# Altium schematic sheet Power.SchDoc
size A
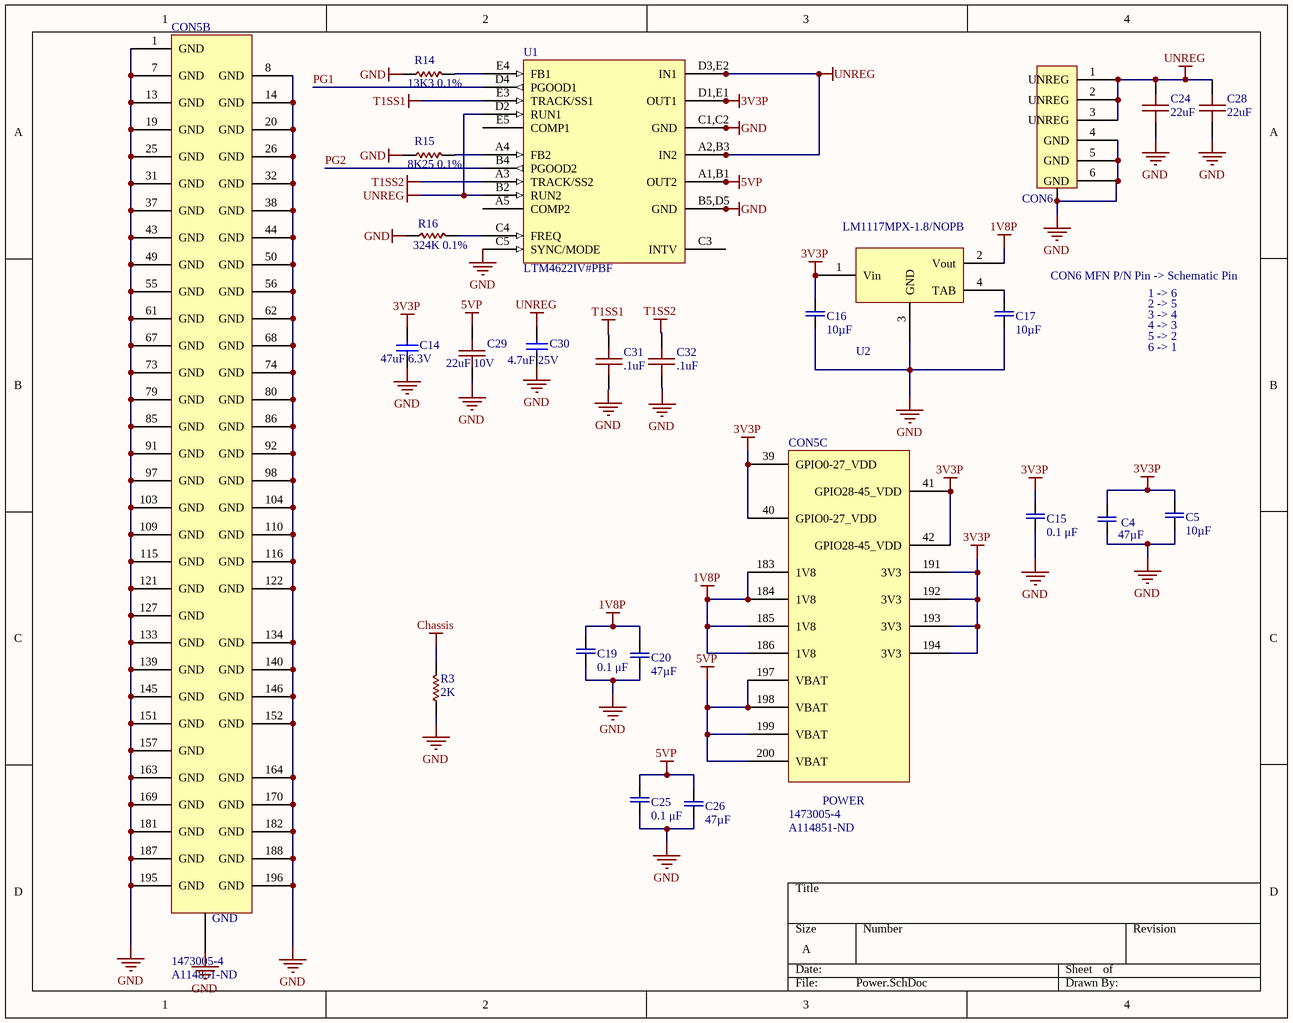
[diagram p0: Power.SchDoc]

## Parts
C4  Capacitance: 47µF  [1210_X7R_KEMET_above4.7uF]  (hidden comment: C1210C476M8RAC7800)
C5  Capacitance: 10µF  [0805_X7R_KEMET]  (hidden comment: C0805C106M8RACTU)
C14  47uF 6.3V  [CAPC0805(2012)145_M]
C15  Capacitance: 0.1 μF  [0805_X7R_KEMET]  (hidden comment: C0805C104K5RACTU)
C16  Capacitance: 10µF  [0805_X7R_KEMET]  (hidden comment: C0805C106M8RACTU)
C17  Capacitance: 10µF  [0805_X7R_KEMET]  (hidden comment: C0805C106M8RACTU)
C19  Capacitance: 0.1 μF  [0805_X7R_KEMET]  (hidden comment: C0805C104K5RACTU)
C20  Capacitance: 47µF  [1210_X7R_KEMET_above4.7uF]  (hidden comment: C1210C476M8RAC7800)
C24  22uF  [0805 B]
C25  Capacitance: 0.1 μF  [0805_X7R_KEMET]  (hidden comment: C0805C104K5RACTU)
C26  Capacitance: 47µF  [1210_X7R_KEMET_above4.7uF]  (hidden comment: C1210C476M8RAC7800)
C28  22uF  [0805 B]
C29  22uF 10V  [0805 B]
C30  4.7uF 25V  [CAPC0603(1608)100_N]
C31  .1uF  [0402 B]
C32  .1uF  [0402 B]
CON5  1473005-4  Supplier Part Number 1: A114851-ND  [SODIMM SOCKET .6 PITCH 200 POS RIGHT ANGLE]  (parts B,C of 9)
CON6  T1M-06-F-SH-L-K  [T1M-06-F-SH-L-K]  (value not drawn)
R3  2K  [0402]
R14  13K3 0.1%  [0402]
R15  8K25 0.1%  [0402]
R16  324K 0.1%  [0603]
U1  LTM4622IV#PBF  [LGA 25]
U2  LM1117MPX-1.8/NOPB  [SOT230P700X180-4N]

## Nets
1V8P: C19.1 C20.1 CON5.183(1V8) CON5.184(1V8) CON5.185(1V8) CON5.186(1V8) U2.2(Vout)
3V3P: C4.1 C5.1 C14.2 C15.1 C16.1 CON5.39(GPIO0-27_VDD) CON5.40(GPIO0-27_VDD) CON5.41(GPIO28-45_VDD) CON5.42(GPIO28-45_VDD) CON5.191(3V3) CON5.192(3V3) CON5.193(3V3) CON5.194(3V3) U1.D1,E1(OUT1) U1.E1(OUT1) U2.1(Vin)
5VP: C25.1 C26.1 C29.2 CON5.197(VBAT) CON5.198(VBAT) CON5.199(VBAT) CON5.200(VBAT) U1.A1,B1(OUT2) U1.B1(OUT2)
Chassis: R3.1
GND: C4.2 C5.2 C14.1 C15.2 C16.2 C17.2 C19.2 C20.2 C24.1 C25.2 C26.2 C28.1 C29.1 C30.1 C31.1 C32.1 CON5.1(GND) CON5.7(GND) CON5.8(GND) CON5.13(GND) CON5.14(GND) CON5.19(GND) CON5.20(GND) CON5.25(GND) CON5.26(GND) CON5.31(GND) CON5.32(GND) CON5.37(GND) CON5.38(GND) CON5.43(GND) CON5.44(GND) CON5.49(GND) CON5.50(GND) CON5.55(GND) CON5.56(GND) CON5.61(GND) CON5.62(GND) CON5.67(GND) CON5.68(GND) CON5.73(GND) CON5.74(GND) CON5.79(GND) CON5.80(GND) CON5.85(GND) CON5.86(GND) CON5.91(GND) CON5.92(GND) CON5.97(GND) CON5.98(GND) CON5.103(GND) CON5.104(GND) CON5.109(GND) CON5.110(GND) CON5.115(GND) CON5.116(GND) CON5.121(GND) CON5.122(GND) CON5.127(GND) CON5.133(GND) CON5.134(GND) CON5.139(GND) CON5.140(GND) CON5.145(GND) CON5.146(GND) CON5.151(GND) CON5.152(GND) CON5.157(GND) CON5.163(GND) CON5.164(GND) CON5.169(GND) CON5.170(GND) CON5.181(GND) CON5.182(GND) CON5.187(GND) CON5.188(GND) CON5.195(GND) CON5.196(GND) CON5.GND CON6.4(GND) CON6.5(GND) CON6.6(GND) CON6.GND R3.2 R14.2 R15.2 R16.2 U1.B5,D5(GND) U1.C1,C2(GND) U1.C2(GND) U1.C5(SYNC/MODE) U1.D5(GND) U2.3(GND)
T1SS1: C31.2 U1.E3(TRACK/SS1)
T1SS2: C32.2 U1.A3(TRACK/SS2)
UNREG: C24.2 C28.2 C30.2 CON6.1(UNREG) CON6.2(UNREG) CON6.3(UNREG) U1.A2,B3(IN2) U1.B2(RUN2) U1.B3(IN2) U1.D2(RUN1) U1.D3,E2(IN1) U1.E2(IN1)
PG1: U1.D4(PGOOD1)
PG2: U1.B4(PGOOD2)
NetC17_1: C17.1 U2.4(TAB)
NetR14_1: R14.1 U1.E4(FB1)
NetR15_1: R15.1 U1.A4(FB2)
NetR16_1: R16.1 U1.C4(FREQ)

Not connected (* = marked no-connect by the designer): U1 A5(COMP2) C3(INTV) E5(COMP1)

## Notes on the sheet
- CON6 MFN P/N Pin -> Schematic Pin
- 1 -> 6
- 2 -> 5
- 3 -> 4
- 4 -> 3
- 5 -> 2
- 6 -> 1
- (in symbol 1473005-4, part C) POWER

## Library data of the parts
C4 C20 C26 = C1210C476M8RAC7800: Manufacturer: Kemet; Tolerance: ±20%; Voltage - Rated: 10V; Temperature Coefficient: X7R; Supplier 1: Digikey; Manufacturer Part Number: C1210C476M8RAC7800; Stock 1: 9455; Pricing 1: 1=1.47, 10=1.159, 25=1.0628, 50=1.0046, 100=0.8694, 250=0.7728, 500=0.6569 (USD); Category: Capacitors; Family: Ceramic Capacitors; Series: C; Packaging: Tape &amp; Reel (TR); Mounting Type: Surface Mount, MLCC; Operating Temperature: -55°C ~ 125°C; Applications: General Purpose; Ratings: -; Package / Case: 1210 (3225 Metric); Size / Dimension: 0.126" L x 0.098" W (3.20mm x 2.50mm); Height - Seated (Max): -; Thickness (Max): 0.110" (2.80mm); Lead Spacing: -; Features: -; Lead Style: -; ComponentLink1URL: http://www.alliedelec.com/m/d/51f554c3dd800f51434b811e71a34895.pdf; ComponentLink1Description: http://www.alliedelec.com/m/d/51f554c3dd800f51434b811e71a34895.pdf; Supplier Part Number 1: 399-12072-1-ND
C5 C16 C17 = C0805C106M8RACTU: Manufacturer: Kemet; Capacitance Tolerance: ± 20%; Capacitor Case Style: 0805 [2012 Metric]; Dielectric Characteristic: X7R; Product Range: KEMET - C Series; SVHC: No SVHC (16-Jun-2014); Voltage Rating: 10V; Supplier 1: Digikey; Manufacturer Part Number: C0805C106M8RACTU; Stock 1: 17950; Pricing 1: 1=0.52, 10=0.362, 25=0.2972, 50=0.2536, 100=0.2174, 250=0.1811, 500=0.163, 1000=0.1377 (USD); Ceramic Capacitor Case: 0805 [2012 Metric]; MSL: MSL 1 - Unlimited; Operating Temperature Max: 125°C; Operating Temperature Min: -55°C; Packaging: Tape & Reel; ComponentLink1URL: https://datasheet.ciiva.com/5408/kem-c1002-x7r-smd-5408794.pdf; ComponentLink1Description: https://datasheet.ciiva.com/5408/kem-c1002-x7r-smd-5408794.pdf; Supplier Part Number 1: 399-7413-1-ND
C14 = CMP-1036-04876-1: GRM21BR60J476ME15L; Case-EIA: 0805; Case-Metric: 2012; Tolerance: Â±10%; Value: 4.7uF; Technology: SMT; Max Thickness: 1.45 mm; Rated Voltage: 6.3 V
C15 C19 C25 = C0805C104K5RACTU: Manufacturer: Kemet; Manufacturer Part Number: C0805C104K5RAC-TU; Brand/Series: C Series; Dielectric Characteristic: X7R; Material, Element: Ceramic; Tolerance: -10, +10 %; Voltage, Rating: 50 VDC; Supplier 1: Digikey; Stock 1: 2895664; Pricing 1: 1=0.1, 10=0.053, 25=0.0388, 50=0.029, 100=0.0237, 250=0.0198, 500=0.0169, 1000=0.0133 (USD); Case Size: 0805 (2012 mm); Dimensions: 0.079" x 0.049" (2 x 1.25mm) LxW; Mounting Type: PCB; Packaging: Cut Tape; Termination: SMD; ComponentLink1URL: https://datasheet.ciiva.com/14589/70095383-14589048.pdf; ComponentLink1Description: https://datasheet.ciiva.com/14589/70095383-14589048.pdf; ComponentLink2URL: https://datasheet.ciiva.com/28682/1851736-28682232.pdf; ComponentLink2Description: https://datasheet.ciiva.com/28682/1851736-28682232.pdf; ComponentLink3URL: https://datasheet.ciiva.com/7842/1851736-7842539.pdf; ComponentLink3Description: https://datasheet.ciiva.com/7842/1851736-7842539.pdf; ComponentLink4URL: https://datasheet.ciiva.com/32431/slceramic-chip-condensers-e-32431755.pdf; ComponentLink4Description: https://datasheet.ciiva.com/32431/slceramic-chip-condensers-e-32431755.pdf; ComponentLink5URL: https://datasheet.ciiva.com/18410/70095383-18410815.pdf; ComponentLink5Description: https://datasheet.ciiva.com/18410/70095383-18410815.pdf; Supplier Part Number 1: 399-1170-1-ND
C24 C28 C29 = CAP 0805: 805 Capacitor
C30 = CMP-1035-01192-1: GRM188C81E475KE11D; Value: 75pF; Case-Metric: 1608; Case-EIA: 0603; Tolerance: Â±10%; Technology: SMT; Rated Voltage: 25 V; Max Thickness: 1 mm
C31 C32 = CAP 0402: 402 Capacitor; Value: .1uF
CON5 = 1473005-4: Manufacturer: TE Connectivity (Tyco Electronics); Unit PriceUSD: AMP; Minimum Quantity: SODIMM; 3D Model: 1473005-4.pdf; Number of Positions: 200; Memory Type: DDR 2 SDRAM; Other Names: 1473005-4-ND / A114851; Supplier 1: Digikey; Manufacturer Part Number: 1473005-4; Stock 1: 1922; Pricing 1: 1=3.9, 10=3.744, 50=3.276, 100=3.12, 250=2.73, 500=2.652, 1000=2.262, 2500=2.106 (USD); Quantity Available: Tray; RoHS Information: 1473005-4 Statement of Compliance / RoHS 2 Statement; Standard Package: 20; Category: Connectors, Interconnects; Family: Memory Connectors - Inline Module Sockets; Series: AMP; Packaging: Tray; Connector Style: SODIMM; Mounting Type: Surface Mount, Right Angle; Features: Board Guide, Latches; Mounting Feature: Standard; Contact Finish: Gold; Contact Finish Thickness: Flash; ComponentLink1URL: https://datasheet.ciiva.com/682/eng-cd-1473005-j2-682720.pdf; ComponentLink1Description: https://datasheet.ciiva.com/682/eng-cd-1473005-j2-682720.pdf; ComponentLink2URL: https://datasheet.ciiva.com/15171/getdatasheetpartid-99150-15171488.pdf; ComponentLink2Description: https://datasheet.ciiva.com/15171/getdatasheetpartid-99150-15171488.pdf; ComponentLink3URL: https://datasheet.ciiva.com/1105/582309-1105221.pdf; ComponentLink3Description: https://datasheet.ciiva.com/1105/582309-1105221.pdf; ComponentLink4URL: https://datasheet.ciiva.com/682/eng-cd-1473005-j2-682726.pdf; ComponentLink4Description: https://datasheet.ciiva.com/682/eng-cd-1473005-j2-682726.pdf; ComponentLink5URL: https://datasheet.ciiva.com/14156/04821302-14156311.pdf; ComponentLink5Description: https://datasheet.ciiva.com/14156/04821302-14156311.pdf; ComponentLink6URL: https://datasheet.ciiva.com/3136/eng-cd-1473005-j-3136060.pdf; ComponentLink6Description: https://datasheet.ciiva.com/3136/eng-cd-1473005-j-3136060.pdf; ComponentLink7URL: https://datasheet.ciiva.com/16380/eng-cd-1473005-j-16380909.pdf; ComponentLink7Description: https://datasheet.ciiva.com/16380/eng-cd-1473005-j-16380909.pdf; ComponentLink8URL: https://datasheet.ciiva.com/16651/eng-cd-1473005-j-16651646.pdf; ComponentLink8Description: https://datasheet.ciiva.com/16651/eng-cd-1473005-j-16651646.pdf
CON6 = T1M-06-F-SH-L-K: 6 Positions Header Connector Surface Mount, Right Angle; Manufacturer: Samtec; Supplier 1: Digi-Key; Manufacturer Part Number: T1M-06-F-SH-L-K; Stock 1: 0; Supplier Part Number 1: SAM11991-ND
R3 R14 R15 = RES 0402: 402 Resistor
R16 = RES 0603: 603 Resistor
U1 = LTM4622: Dual Ultrathin 2.5A or Single 5A Step-Down DC/DC μModule Regulator; Ref: LTM4622IV#PBF
U2 = LM1117MPX-1.8/NOPB: LDO; Manufacturer: Texas Instruments (TI) / National Semiconductor; DELETED: Compliant; Dropout Voltage@Current (Max): 1.2@100mA/1.25@500mA; Dropout Voltage@Current (Typ): 1.1@100mA/1.15@500mA; Input Voltage: 15 V; Line Regulation: 1mV; Number of Outputs: Single; Output Current: 1.5 A; Output Voltage: 1.8 V; Output Voltage Accuracy: ?1 %; Polarity Type: Positive; Quiescent Current (Max): 10 mA; Rad Hardened: No; Regulator Output Type: Fixed; Voltage Regulator Type: Linear; Supplier 1: Digikey; Manufacturer Part Number: LM1117MPX-1.8/NOPB; Stock 1: 19027; Pricing 1: 1=1.04, 10=0.927, 100=0.7225, 500=0.5969, 1000=0.4712 (USD); Input Voltage (Max): 15 V; Load Regulation: 1mV; Mounting: Surface Mount; Operating Temp Range: 0C to 125C; Operating Temperature Classification: Commercial; Package Type: SOT-223; Packaging: Tape and Reel; Pin Count: 3 +Tab; Topology: LDO; ComponentLink1URL: https://datasheet.ciiva.com/34302/1282521-34302144.pdf; ComponentLink1Description: https://datasheet.ciiva.com/34302/1282521-34302144.pdf; ComponentLink2URL: https://datasheet.ciiva.com/15111/getdatasheetpartid-112508-15111793.pdf; ComponentLink2Description: https://datasheet.ciiva.com/15111/getdatasheetpartid-112508-15111793.pdf; ComponentLink3URL: https://datasheet.ciiva.com/3223/lm1117-n-3223526.pdf; ComponentLink3Description: https://datasheet.ciiva.com/3223/lm1117-n-3223526.pdf; ComponentLink4URL: https://datasheet.ciiva.com/3223/lm1117-n-3223527.pdf; ComponentLink4Description: https://datasheet.ciiva.com/3223/lm1117-n-3223527.pdf; ComponentLink5URL: https://datasheet.ciiva.com/6591/lm1117-n-6591863.pdf; ComponentLink5Description: https://datasheet.ciiva.com/6591/lm1117-n-6591863.pdf; ComponentLink6URL: https://datasheet.ciiva.com/6591/lm1117-n-6591864.pdf; ComponentLink6Description: https://datasheet.ciiva.com/6591/lm1117-n-6591864.pdf; ComponentLink7URL: https://datasheet.ciiva.com/6591/lm1117-n-6591865.pdf; ComponentLink7Description: https://datasheet.ciiva.com/6591/lm1117-n-6591865.pdf; ComponentLink8URL: https://datasheet.ciiva.com/46386/1882372-46386047.pdf; ComponentLink8Description: https://datasheet.ciiva.com/46386/1882372-46386047.pdf; Supplier Part Number 1: LM1117MPX-1.8/NOPBCT-ND